# Altium schematic sheet SN54LS145N_CommunicationInterface.SchDoc
size A4
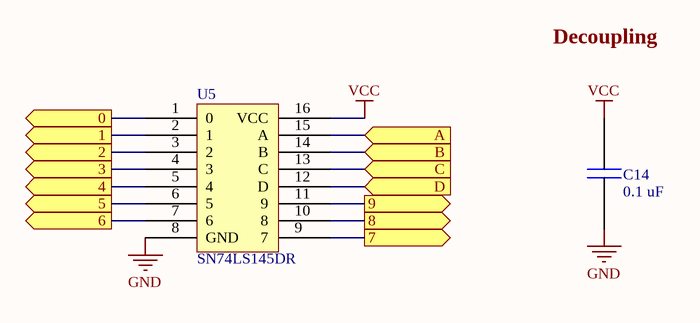
[diagram p0: SN54LS145N_CommunicationInterface.SchDoc]

## Parts
C14  value 0.1 uF  [CAP0603]  (hidden comment: CAP0.1uF)
U5  SN74LS145DR  [SOIC16]

## Ports
0 (out), 1 (out), 2 (out), 3 (out), 4 (out), 5 (out), 6 (out), 7 (out), 8 (out), 9 (out), A (in), B (in), C (in), D (in)

## Nets
GND: C14.2 U5.8(GND)
VCC: C14.1 U5.16(VCC)
0: U5.1(0) ; port 0
1: U5.2(1) ; port 1
2: U5.3(2) ; port 2
3: U5.4(3) ; port 3
4: U5.5(4) ; port 4
5: U5.6(5) ; port 5
6: U5.7(6) ; port 6
7: U5.9(7) ; port 7
8: U5.10(8) ; port 8
9: U5.11(9) ; port 9
A: U5.15(A) ; port A
B: U5.14(B) ; port B
C: U5.13(C) ; port C
D: U5.12(D) ; port D

## Notes on the sheet
- Labels drawn without touching a wire or pin: Decoupling

## Library data of the parts
C14 = C0.1UF: Capacitores cerámicos de capas múltiples (MLCC) - SMD/SMT 0603 0.1uF 16volts X7R 5%; MPN: VJ0603Y104JXJPW1BC; Supplier PN: 77-VJ0603Y104JXJPBC; Supplier: Mouser
U5 = SN74LS145DR: Codificadores, decodificadores, multiplexores y demultiplexores BCD-To-Decimal Decoders/Drivers; Value: BCD; Supplier: Mouser; Supplier PN: 595-SN74LS145DR; MPN: SN74LS145DR